# EAGLE design switch-2layer-4 (EAGLE 9.2.2)
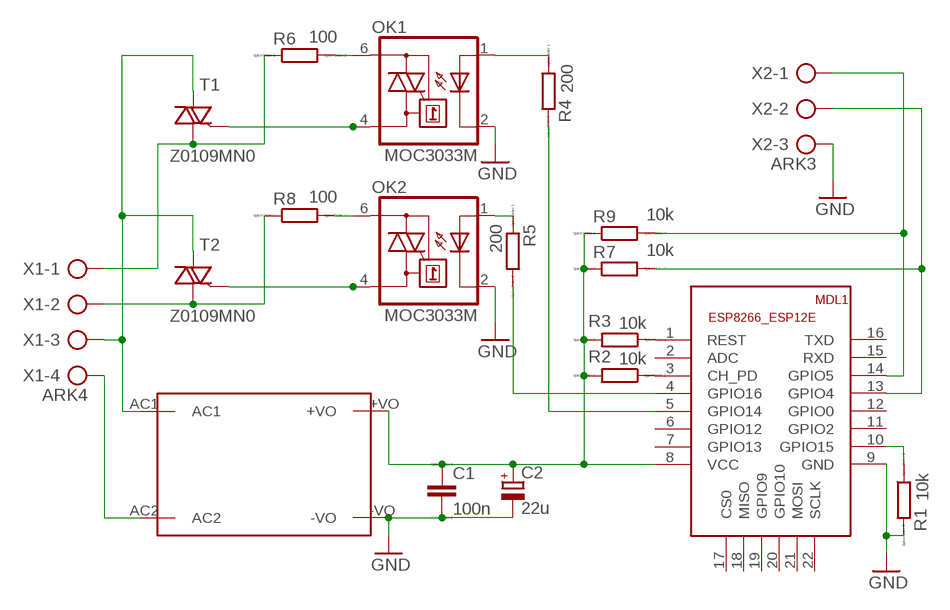
[diagram p0: schematic, sheet 1]

## Parts
C1  100n  CC1206  [C1206]
C2  22u  CPOL-EUE2.5-6  [E2,5-6]
MDL1  ESP12-F  ESP8266-12EESP8266-ESP12E  [ESP8266-ESP12E]
OK1  MOC3033M  [DIL06]
OK2  MOC3033M  [DIL06]
R1  10k  RR1206  [R1206]
R2  10k  RR1206  [R1206]
R3  10k  RR1206  [R1206]
R4  200  RR1206  [R1206]
R5  200  RR1206  [R1206]
R6  100  RR1206  [R1206]
R7  10k  RR1206  [R1206]
R8  100  RR1206  [R1206]
R9  10k  RR1206  [R1206]
T1  Z0109MN0  [SOT223]
T2  Z0109MN0  [SOT223]
U$1  HLK-PM03  [HLK-PM03]
X1  ARK4  AK500/4  [AK500/4]
X2  ARK3  AK500/3  [AK500/3]

## Nets
GND: C1.2 C2.- MDL1.9(GND) OK1.2(C) OK2.2(C) R1.2 U$1.-VO X2.3
N$1: MDL1.10(GPIO15) R1.1
N$2: MDL1.1(REST) R3.1
N$3: MDL1.3(CH_PD) R2.1
N$4: C1.1 C2.+ MDL1.8(VCC) R2.2 R3.2 R7.1 R9.1 U$1.+VO
N$5: OK1.6(A2) R6.2
N$7: OK2.6(A2) R8.2
N$9: OK2.1(A) R5.1
N$10: OK1.1(A) R4.1
N$11: MDL1.4(GPIO16) R5.2
N$12: MDL1.5(GPIO14) R4.2
N$14: OK1.4(A1) T1.3(G)
N$15: R8.1 T2.2(CM) T2.4(CM) X1.2
N$16: OK2.4(A1) T2.3(G)
N$17: U$1.AC2 X1.4
N$19: T1.1(LD) T2.1(LD) U$1.AC1 X1.3
N$20: MDL1.14(GPIO5) R9.2 X2.1
N$21: MDL1.13(GPIO4) R7.2 X2.2
N$22: R6.1 T1.2(CM) T1.4(CM) X1.1
Unconnected: MDL1.2(ADC) MDL1.6(GPIO12) MDL1.7(GPIO13) MDL1.11(GPIO2) MDL1.12(GPIO0) MDL1.15(RXD) MDL1.16(TXD) MDL1.17(CS0) MDL1.18(MISO) MDL1.19(GPIO9) MDL1.20(GPIO10) MDL1.21(MOSI) MDL1.22(SCLK)

## Library data of the parts
C1 = eagle-ltspice:C: CAPACITOR, European symbol; SPICEMODEL: NONE; SPICEPREFIX: C
C2 = rcl:CPOL-EU: POLARIZED CAPACITOR, European symbol; SPICEPREFIX: C
MDL1 = ESP8266-ESP12E:ESP8266-12E: ESP8266-12E with additional I/O and GPIO04/05 corrected The author cannot warrant that this library is free from error or will meet your specific requirements. Created by PuceBaboon.com. Komagane, Nagano, JAPAN
OK1 OK2 = optocoupler:MOC30*: 6-Pin DIP Zero-Cross Optoisolators Triac Driver Output (250/400 Volt Peak) Source: Data sheet <http://www.fairchildsemi.com/ds/MO/MOC3031M.pdf> The old path of data sheet not more available 2013-05-06.; MF: FAIRCHILD SEMICONDUCTOR; MPN: MOC3033-M; OC_FARNELL: 1133987; OC_NEWARK: 72K8898
R1-R9 = eagle-ltspice:R: RESISTOR, European symbol; SPICEMODEL: NONE; SPICEPREFIX: R
T1 T2 = nxp_60_1_1:Z0109MN0: 4Q Triac Planar passivated sensitive gate four quadrant triac in a SOT223 (SC-73) surface-mountable plastic package intended for applications requiring enhanced immunity to noise and direct interfacing to logic level ICs and low power gate drivers. AAL Eindhoven MK; 12NC: 9340 650 56135
U$1 = PowerSocket:HLK-PM03
X1 = con-ptr500:AK500/4: CONNECTOR; OC_FARNELL: unknown; OC_NEWARK: unknown
X2 = con-ptr500:AK500/3: CONNECTOR; OC_FARNELL: unknown; OC_NEWARK: unknown

## Board
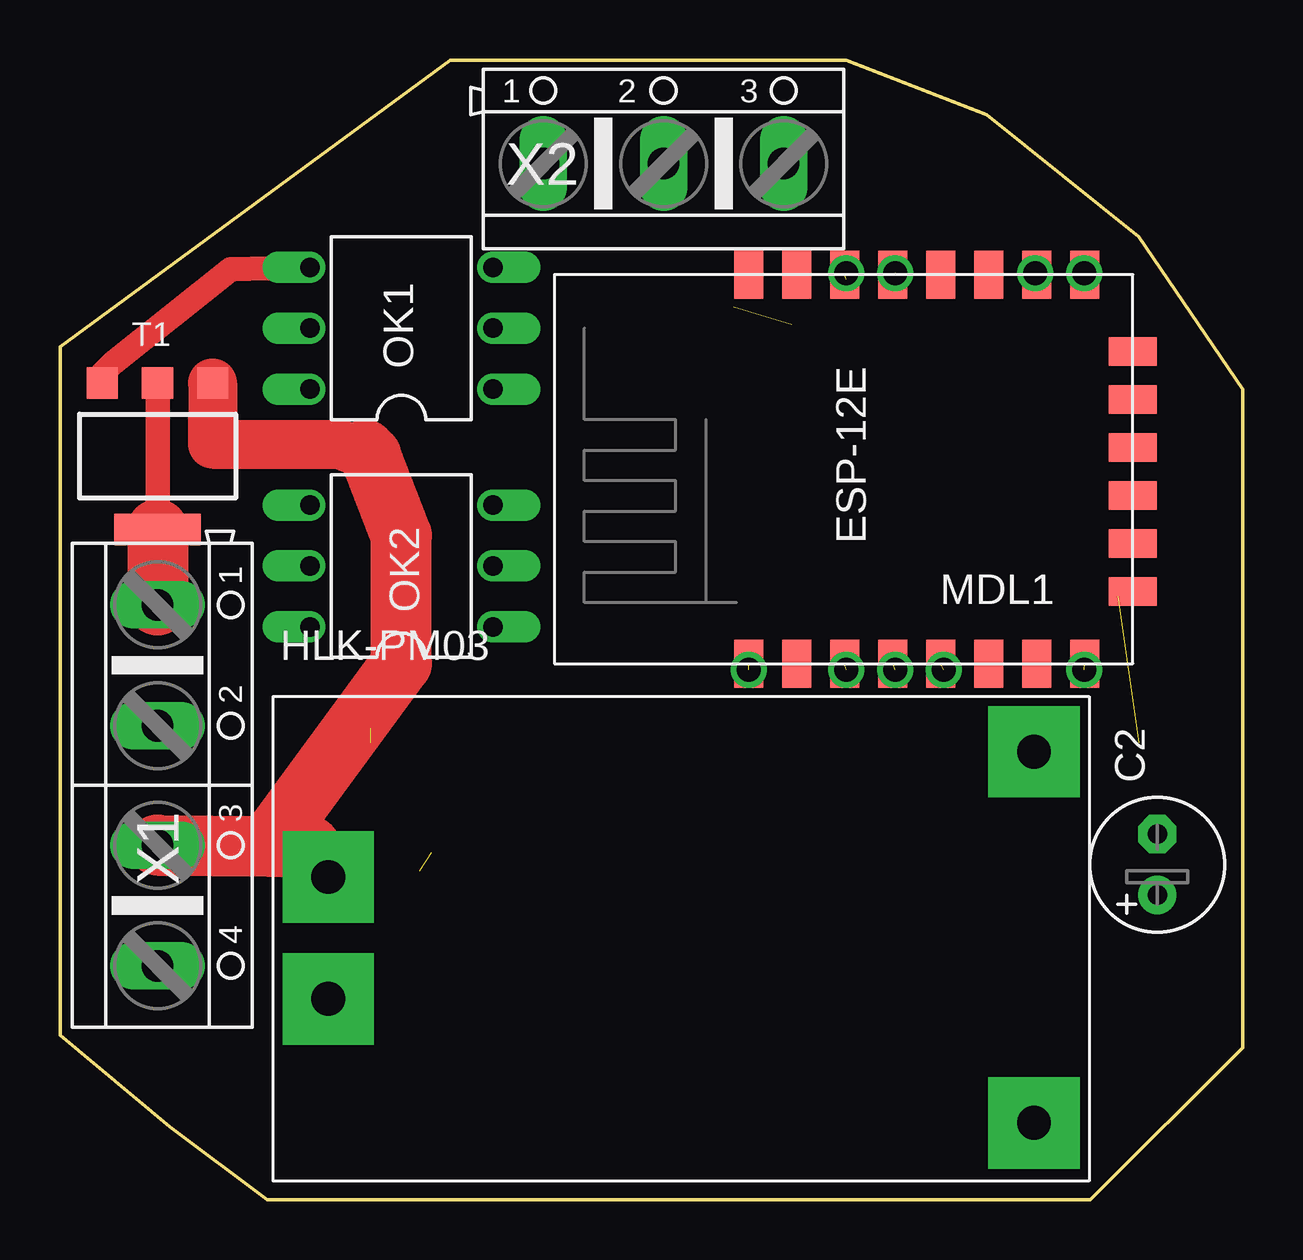
[diagram p1: board, top side]
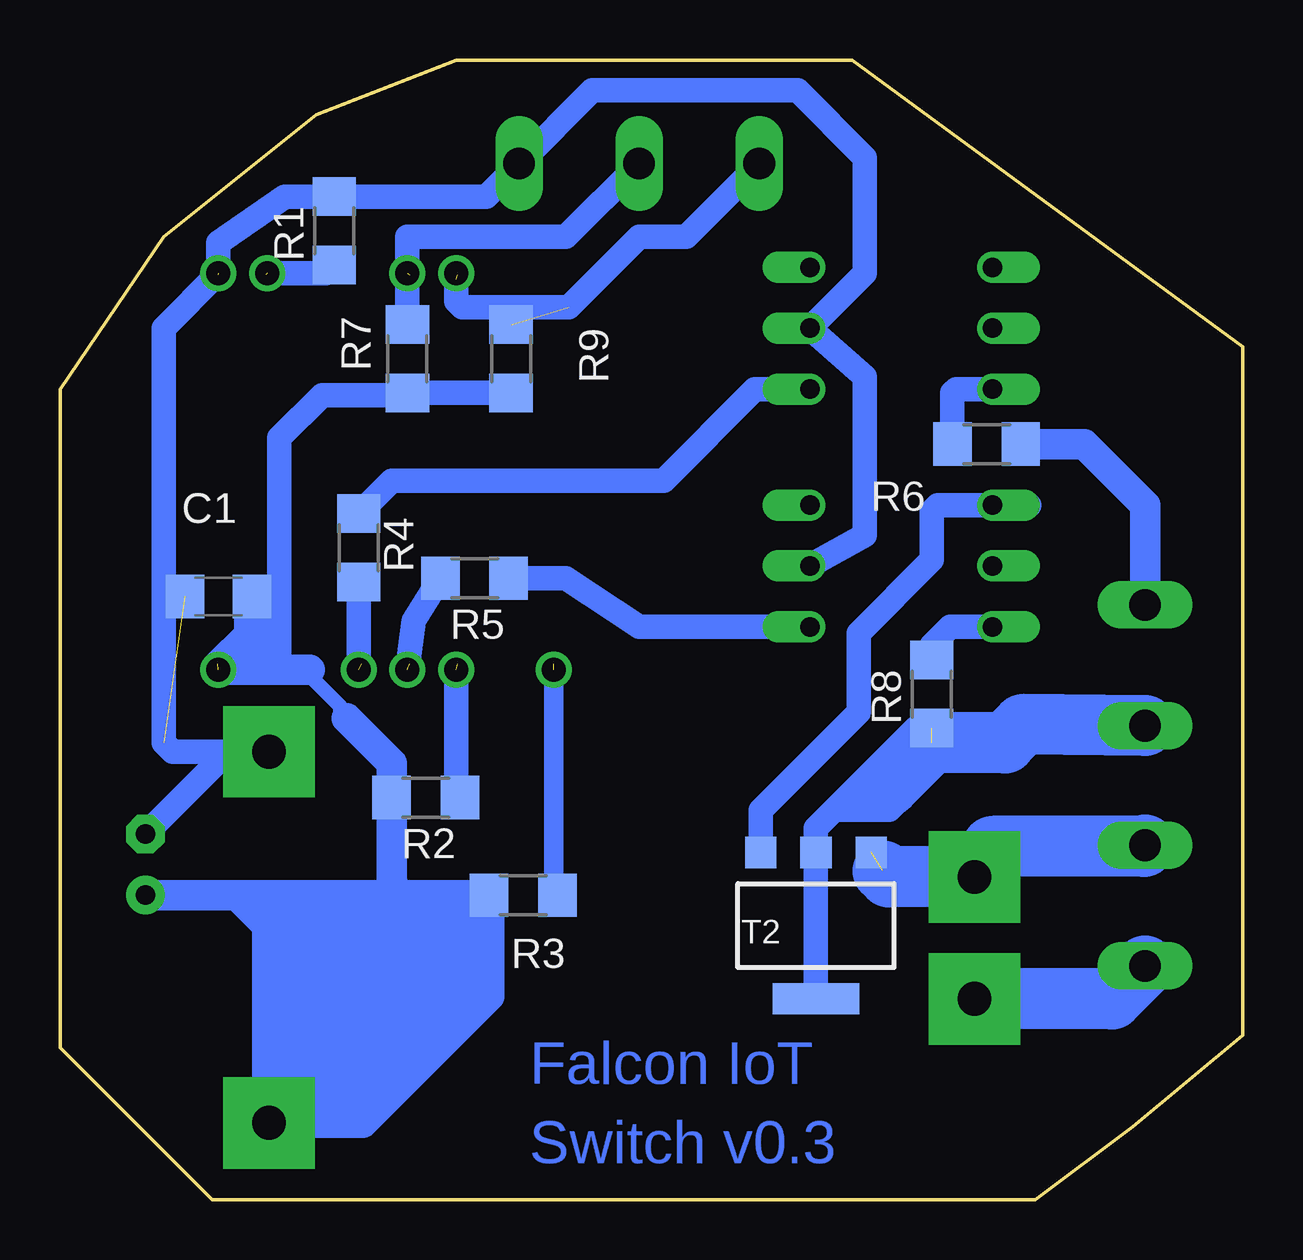
[diagram p2: board, bottom side, seen from below]

Size 49.28 x 47.5 mm. Coordinates in mm from the lower left corner, seen from the top.
Outline: 42.93,0 49.28,6.35 49.28,33.78 44.96,40.13 38.61,45.21 32.77,47.5 16.26,47.5 0,35.56 0,6.86 4.57,3.05 8.64,0 42.93,0
Copper layers (1*16): Top 0.035mm / dielectric 1.5mm / Bottom 0.035mm
Design rules "default": minimum track width 6mil, minimum drill 0.35mm, track to track 6mil, track to pad 6mil, pad to pad 6mil, via to via 6mil, smd to smd 6mil, copper to edge 40mil, drill to drill 6mil, minimum pad ring 10mil, minimum via ring 8mil, stop-mask expansion 4mil, vias tented up to drill 0mil, thermal gap 10mil

### Footprints (pad centres in the part's own frame; a part is rotated, then mirrored left to right if it is on the bottom)
C1206 = smd 1.6 x 1.8: 1 -1.4,0; 2 1.4,0
E2,5-6 = drill 0.813 pad 1.6: + -1.27,0 | drill 0.813 pad 1.6 octagon: - 1.27,0
ESP8266-ESP12E = smd 2 x 1.2: 1 0,16; 2 0,14; 3 0,12; 4 0,10; 5 0,8; 6 0,6; 7 0,4; 8 0,2; 9 16.2,2; 10 16.2,4; 11 16.2,6; 12 16.2,8; 13 16.2,10; 14 16.2,12; 15 16.2,14; 16 16.2,16 | smd 1.2 x 2: 17 11,0; 18 3,0; 19 5,0; 20 13,0; 21 7,0; 22 9,0
DIL06 = drill 0.813 offset: 1 -2.54,-3.81; 2 0,-3.81; 3 2.54,-3.81; 4 2.54,3.81; 5 0,3.81; 6 -2.54,3.81
R1206 = smd 1.6 x 1.803: 1 -1.422,0; 2 1.422,0
SOT223 = smd 1.3 x 1.3: 1 -2.3,-3.05; 2 0,-3.05; 3 2.3,-3.05 | smd 3.6 x 1.3: 4 0,3.05
HLK-PM03 = drill 1.4 pad 3.81 square: +VO 29.4,-5.167; -VO 29.4,10.294; AC1 0,5.08; AC2 0,0
AK500/4 = drill 1.321 long: 1 -7.518,0; 2 -2.489,0; 3 2.489,0; 4 7.518,0
AK500/3 = drill 1.321 long: 1 -5.004,0; 2 0,0; 3 5.004,0

### Placement (x,y rotation side)
C1  42.67,25.15 180 bottom
C2  45.72,13.97 90 top
MDL1  44.7,22.35 90 top
OK1  14.22,36.32 90 top
OK2  14.22,26.42 90 top
R1  37.85,40.39 90 bottom
R2  34.04,16.76 180 bottom
R3  29.97,12.7 180 bottom
R4  36.83,27.18 270 bottom
R5  32,25.91 180 bottom
R6  10.67,31.5 180 bottom
R7  34.8,35.05 90 bottom
R8  12.95,21.08 90 bottom
R9  30.48,35.05 90 bottom
T1  4.06,30.99 180 top
T2  17.78,11.43 180 bottom
U$1  11.18,8.38 0 top
X1  4.06,17.27 270 top
X2  25.15,43.18 0 top

### Tracks (layer width: path | path; a pad name or v marks a point on that pad's centre or on a via)
GND  (via drill 1)  (2 unrouted)
  Bottom 1.016: OK2.2 15.75,27.69 15.75,34.29 OK1.2 15.75,38.61 15.75,43.43 18.54,46.23 27.1,46.23 X2.3 31.52,41.81 R1.2 39.92,41.81 42.67,39.88 v42.67,38.61 44.96,36.32 44.96,19.05 44.58,18.68 U$1.-VO 42.28,18.68 C2.-
N$1  (via drill 1)  (1 unrouted)
  Bottom 1.016: R1.1 38.2,38.61 v40.64,38.61
N$2  (via drill 1)  (1 unrouted)
  Bottom 0.813: v28.7,22.1 28.7,12.85 R3.1
N$3  (via drill 1)  (1 unrouted)
  Bottom 1.016: R2.1 32.77,16.76 v32.77,22.1
N$4  (via drill 1)  (1 unrouted)
  Bottom 0.61: 37.34,20.07 37.59,20.32 37.59,20.57 38.86,21.84 38.86,22.1
  Bottom 1.016: R3.2 31.65,12.95 | R9.1 R7.1 34.9,33.53 38.35,33.53 40.13,31.75 40.13,22.1 | 40.64,22.1 40.64,22.35 40.89,22.61
  Bottom 1.27: 31.39,8.48 31.39,10.16 | 31.39,10.16 31.39,11.68 | 31.39,11.68 R3.2 35.05,12.7 | 33.66,6.22 36.66,3.21 U$1.+VO 40.64,3.28 40.64,6.1 | 33.66,6.22 32.26,7.62 | 32.26,7.62 31.39,8.48 | 35.05,12.7 35.46,13.11 R2.2 35.46,18.19 37.34,20.07 | 40.64,6.1 40.64,7.62 | 40.64,7.62 40.64,8.89 | 40.64,8.89 40.64,10.16 | 40.64,10.16 40.64,11.43 | 40.64,11.43 41.91,12.7 C2.+ 35.05,12.7 | 31.39,11.68 31.65,11.43 40.64,11.43 | 40.64,10.16 31.39,10.16 | 31.39,8.48 31.8,8.89 40.64,8.89 | 40.64,7.62 32.26,7.62 | 33.66,6.22 40.51,6.22 40.64,6.1 | 40.64,7.62 40.13,7.11 33.78,7.11 35.81,5.08 40.13,5.08 39.12,4.06 36.58,4.06 | 38.86,22.1 40.13,22.1 40.64,22.1 v42.67,22.1
  Bottom 1.524: C1.1 41.27,23.5 v42.67,22.1
N$5
  Bottom 1.016: OK1.6 11.94,33.78 12.09,33.63 R6.2
N$7
  Bottom 1.016: OK2.6 12.19,23.88 12.95,23.11 R8.2
N$9
  Bottom 1.016: OK2.1 25.15,23.88 28.19,25.91 R5.1
N$10
  Bottom 1.016: R4.1 35.46,29.97 24.13,29.97 20.32,33.78 OK1.1
N$11  (via drill 1)  (1 unrouted)
  Bottom 1.016: R5.2 34.54,24.13 v34.8,22.1
N$12  (via drill 1)  (1 unrouted)
  Bottom 1.016: R4.2 v36.83,22.1
N$13  (via drill 1)
  other vias: 32.77,38.61
N$14
  Top 1.016: T1.3 1.76,34.43 2.19,34.85 7.12,38.78 OK1.4
N$15  (1 unrouted)
  Bottom 1.016: 17.02,16.26 17.78,15.49 T2.2 T2.4 | 17.02,16.26 13.61,19.66 R8.1 | 17.02,16.26 14.73,16.26 14.48,16.51
  Bottom 2.54: X1.2 9.14,19.81 9.91,19.05 12.95,19.05 14.73,17.27
N$16
  Bottom 1.016: 8.89,28.96 OK2.4 12.7,28.96 12.95,28.7 12.95,26.67 16,23.62 16,20.32 20.08,16.24 T2.3
N$17
  Bottom 2.54: X1.4 5.44,8.38 U$1.AC2
N$19  (1 unrouted)
  Top 2.032: T1.1 6.35,31.5 11.68,31.5 12.95,30.99
  Top 2.54: X1.3 8.63,14.75 | 8.63,14.75 10.41,14.73 U$1.AC1 | 8.63,14.75 14.22,22.35 14.22,27.69 12.95,30.99 12.7,31.24
  Bottom 2.54: X1.3 4.12,14.73 10.41,14.73 | 11.68,12.95 U$1.AC1 14.73,13.46 14.99,13.72
N$20  (2 unrouted)
  Bottom 1.016: X2.1 23.19,40.13 25.15,40.13 28.08,37.2 32.51,37.2 32.77,37.45 32.77,38.35
N$21  (via drill 1)  (1 unrouted)
  Bottom 1.016: X2.2 28.19,40.13 34.8,40.13 v34.8,38.61 R7.2
N$22
  Top 1.016: T1.2 T1.4
  Top 2.54: T1.4 X1.1
  Bottom 1.27: R6.1 6.6,31.5 4.06,28.96 X1.1

### Text on the board
Bottom: Falcon IoT | Switch v0.3